# Altium schematic sheet power-v5.SchDoc: Power 5V
size Letter; CheckedBy: J. Brinton; CompanyName: Signal Laboratories, Inc.; DrawnBy: J. Brinton; Engineer: J. Brinton; Address1: 3479 Edison Way; Address2: Menlo Park CA 94025; Address3: +1 (877) 778-8435; Address4: siglabs.com; Revision: 3; SheetNumber: 44; SheetTotal: 49
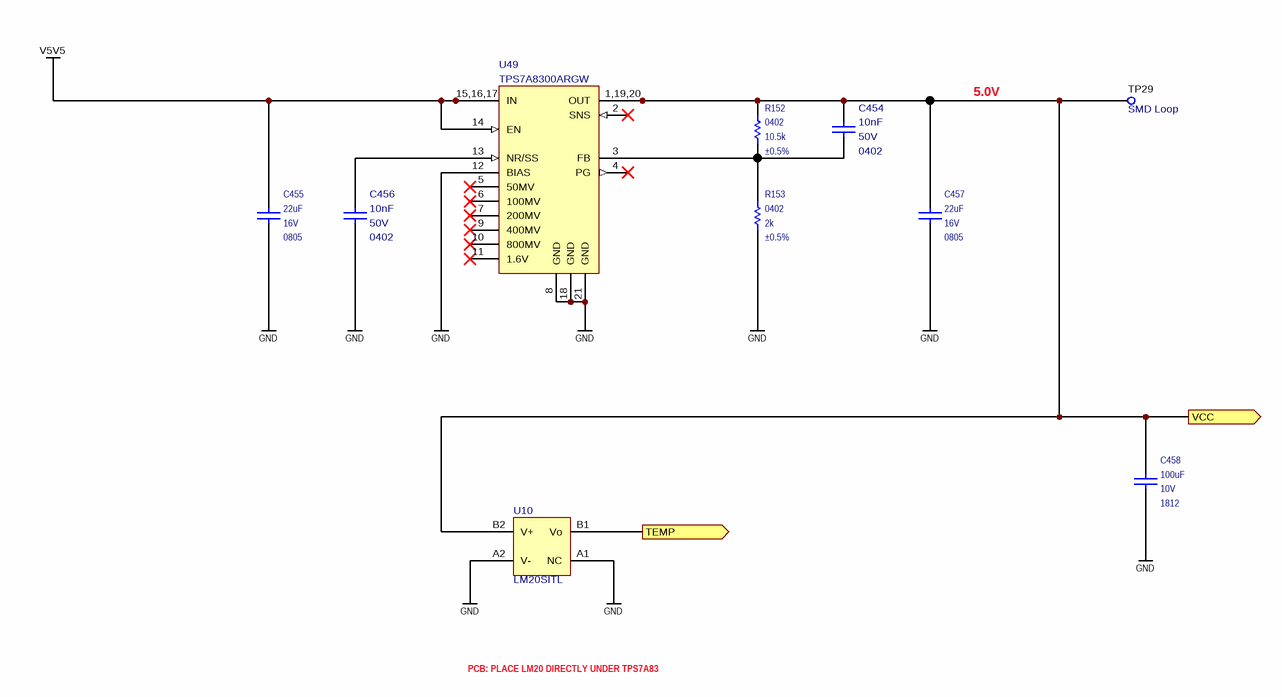
[diagram p0: power-v5.SchDoc]

## Parts
C454  value 10nF  Package: 0402  Voltage: 50V  [CAPC100X50X55L25N]  (hidden comment: GRM155R71H103KA88)
C455  value 22uF  Voltage: 16V  Package: 0805  [CAPC200X125X145L45N]  (hidden comment: CL21A226KOQNNNE)
C456  value 10nF  Package: 0402  Voltage: 50V  [CAPC100X50X55L25N]  (hidden comment: GRM155R71H103KA88)
C457  value 22uF  Voltage: 16V  Package: 0805  [CAPC200X125X145L45N]  (hidden comment: CL21A226KOQNNNE)
C458  value 100uF  Voltage: 10V  Package: 1812  [CAPC450X320X360L20N]  (hidden comment: C4532X5R1A107M280KC)
R152  value 10.5k  Tolerance: ±0.5%  Package: 0402  [RESC1005X40N]  (hidden comment: RT0402DRD0710K5L)
R153  value 2k  Tolerance: ±0.5%  Package: 0402  [RESC1005X40N]  (hidden comment: RR0510P-202-D)
TP29  Notes: SMD Loop  [5015]  (hidden comment: 5015)
U10  LM20SITL  [YZR-4]
U49  TPS7A8300ARGW  [QFN65P500X500X100-21N]

## Ports
TEMP (out), VCC (out)

## Nets
GND: C455.1 C456.2 C457.1 C458.1 R153.1 U10.A1(NC) U10.A2(V-) U49.8(GND) U49.12(BIAS) U49.18(GND) U49.21(GND)
V5V5: C455.2 U49.14(EN) U49.15(IN) U49.16(IN) U49.17(IN)
TEMP: U10.B1(Vo) ; port TEMP
VCC: C454.1 C457.2 C458.2 R152.2 TP29.1 U10.B2(V+) U49.1(OUT) U49.19(OUT) U49.20(OUT) ; port VCC
NetC454_2: C454.2 R152.1 R153.2 U49.3(FB)
NetC456_1: C456.1 U49.13(NR/SS)

Not connected (* = marked no-connect by the designer): U49 2(SNS)* 4(PG)* 5(50MV)* 6(100MV)* 7(200MV)* 9(400MV)* 10(800MV)* 11(1.6V)*

## Notes on the sheet
- 5.0V
- PCB: PLACE LM20 DIRECTLY UNDER TPS7A83
- Title
- Engineer
- Revision
- Drawn By
- Checked By
- Date
- Sheet
- of
- (in symbol TPS7A8300ARGW) 15,16,17; 1,19,20

## Library data of the parts
C454 C456 = TMK105B7103KV: Ceramic Capacitor 10nF ±10% 50V X7R 0402; Manufacturer: Murata; Tr: -55:125; Manufacturer P/N: GRM155R71H103KA88; Tolerance: ±10%
C455 C457 = CAP 0603: Ceramic Capacitor 22uF ±10% 16V X5R 0805; Manufacturer: Samsung; Tr: -55:85; Manufacturer P/N: CL21A226KOQNNNE; Tolerance: ±10%
C458 = CAP 0603: Ceramic Capacitor 100uF ±20% 10V X5R 1812; Manufacturer: TDK; Tr: -55:85; Manufacturer P/N: C4532X5R1A107M280KC; Tolerance: ±20%
R152 = RES: Thin Film Resistor 10.5k +/-0.5% SMD 0402; Manufacturer: Yageo; Tr: -55:155; Power: 0.063W; Tcr: *; Manufacturer P/N: RT0402DRD0710K5L; Alternatives: *; Voltage: *
R153 = RES: Thin Film Resistor 2k +/-0.5% SMD 0402; Manufacturer: Susumu; Tr: -55:155; Tcr: *; Manufacturer P/N: RR0510P-202-D; Alternatives: *; Voltage: *; Power: *
TP29 = TEST_POINT_SMD_50: Test Point SMD; Manufacturer: Keystone; Manufacturer P/N: 5015
U10 = LM20SITL: Analog Temperature Sensor; Manufacturer: Texas Instruments; Manufacturer P/N: LM20SITL; Package: DSBGA-4
U49 = TPS7A8300ARGW: LDO Regulator, 2A, VQFN-20; Manufacturer: Texas Instruments; Package: VQFN-20; Manufacturer P/N: TPS7A8300ARGW